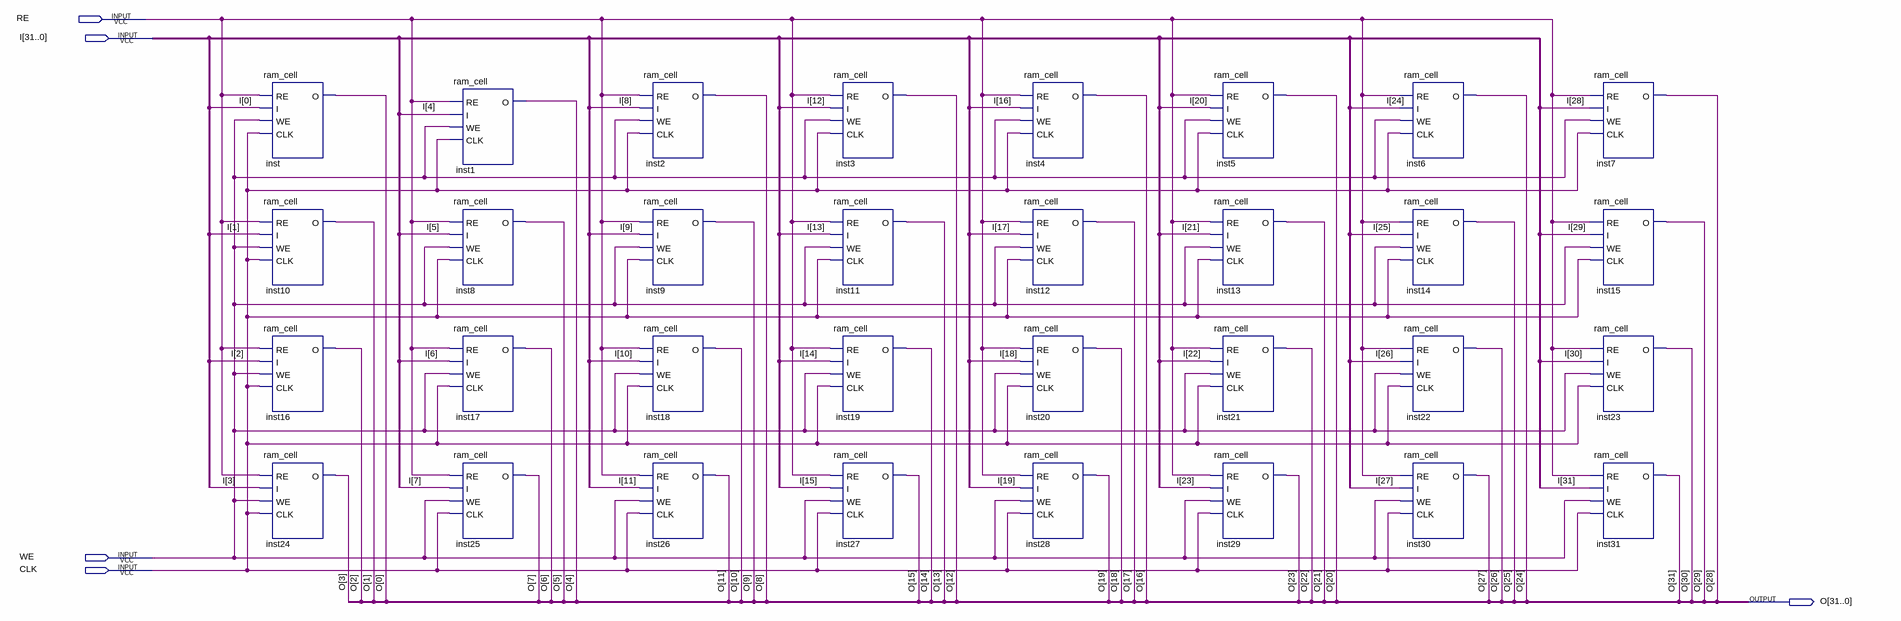
[diagram p0: schematic sheet]
// Quartus schematic ram_cell32.bdf as structural Verilog: 32 symbols, 5 pins
module ram_cell32 (
  input  RE,
  input  [31:0] I,
  input  WE,
  input  CLK,
  output [31:0] O
);

  ram_cell inst (.RE(RE), .I(I[0]), .WE(WE), .CLK(CLK), .O(O[0]));
  ram_cell inst10 (.RE(RE), .I(I[1]), .WE(WE), .CLK(CLK), .O(O[1]));
  ram_cell inst16 (.RE(RE), .I(I[2]), .WE(WE), .CLK(CLK), .O(O[2]));
  ram_cell inst24 (.RE(RE), .I(I[3]), .WE(WE), .CLK(CLK), .O(O[3]));
  ram_cell inst1 (.RE(RE), .I(I[4]), .WE(WE), .CLK(CLK), .O(O[4]));
  ram_cell inst8 (.RE(RE), .I(I[5]), .WE(WE), .CLK(CLK), .O(O[5]));
  ram_cell inst17 (.RE(RE), .I(I[6]), .WE(WE), .CLK(CLK), .O(O[6]));
  ram_cell inst25 (.RE(RE), .I(I[7]), .WE(WE), .CLK(CLK), .O(O[7]));
  ram_cell inst2 (.RE(RE), .I(I[8]), .WE(WE), .CLK(CLK), .O(O[8]));
  ram_cell inst9 (.RE(RE), .I(I[9]), .WE(WE), .CLK(CLK), .O(O[9]));
  ram_cell inst18 (.RE(RE), .I(I[10]), .WE(WE), .CLK(CLK), .O(O[10]));
  ram_cell inst26 (.RE(RE), .I(I[11]), .WE(WE), .CLK(CLK), .O(O[11]));
  ram_cell inst3 (.RE(RE), .I(I[12]), .WE(WE), .CLK(CLK), .O(O[12]));
  ram_cell inst11 (.RE(RE), .I(I[13]), .WE(WE), .CLK(CLK), .O(O[13]));
  ram_cell inst19 (.RE(RE), .I(I[14]), .WE(WE), .CLK(CLK), .O(O[14]));
  ram_cell inst27 (.RE(RE), .I(I[15]), .WE(WE), .CLK(CLK), .O(O[15]));
  ram_cell inst4 (.RE(RE), .I(I[16]), .WE(WE), .CLK(CLK), .O(O[16]));
  ram_cell inst12 (.RE(RE), .I(I[17]), .WE(WE), .CLK(CLK), .O(O[17]));
  ram_cell inst20 (.RE(RE), .I(I[18]), .WE(WE), .CLK(CLK), .O(O[18]));
  ram_cell inst28 (.RE(RE), .I(I[19]), .WE(WE), .CLK(CLK), .O(O[19]));
  ram_cell inst5 (.RE(RE), .I(I[20]), .WE(WE), .CLK(CLK), .O(O[20]));
  ram_cell inst13 (.RE(RE), .I(I[21]), .WE(WE), .CLK(CLK), .O(O[21]));
  ram_cell inst21 (.RE(RE), .I(I[22]), .WE(WE), .CLK(CLK), .O(O[22]));
  ram_cell inst29 (.RE(RE), .I(I[23]), .WE(WE), .CLK(CLK), .O(O[23]));
  ram_cell inst6 (.RE(RE), .I(I[24]), .WE(WE), .CLK(CLK), .O(O[24]));
  ram_cell inst14 (.RE(RE), .I(I[25]), .WE(WE), .CLK(CLK), .O(O[25]));
  ram_cell inst22 (.RE(RE), .I(I[26]), .WE(WE), .CLK(CLK), .O(O[26]));
  ram_cell inst30 (.RE(RE), .I(I[27]), .WE(WE), .CLK(CLK), .O(O[27]));
  ram_cell inst7 (.RE(RE), .I(I[28]), .WE(WE), .CLK(CLK), .O(O[28]));
  ram_cell inst15 (.RE(RE), .I(I[29]), .WE(WE), .CLK(CLK), .O(O[29]));
  ram_cell inst23 (.RE(RE), .I(I[30]), .WE(WE), .CLK(CLK), .O(O[30]));
  ram_cell inst31 (.RE(RE), .I(I[31]), .WE(WE), .CLK(CLK), .O(O[31]));
endmodule
